# Altium schematic sheet Sheet1.SchDoc
size A2
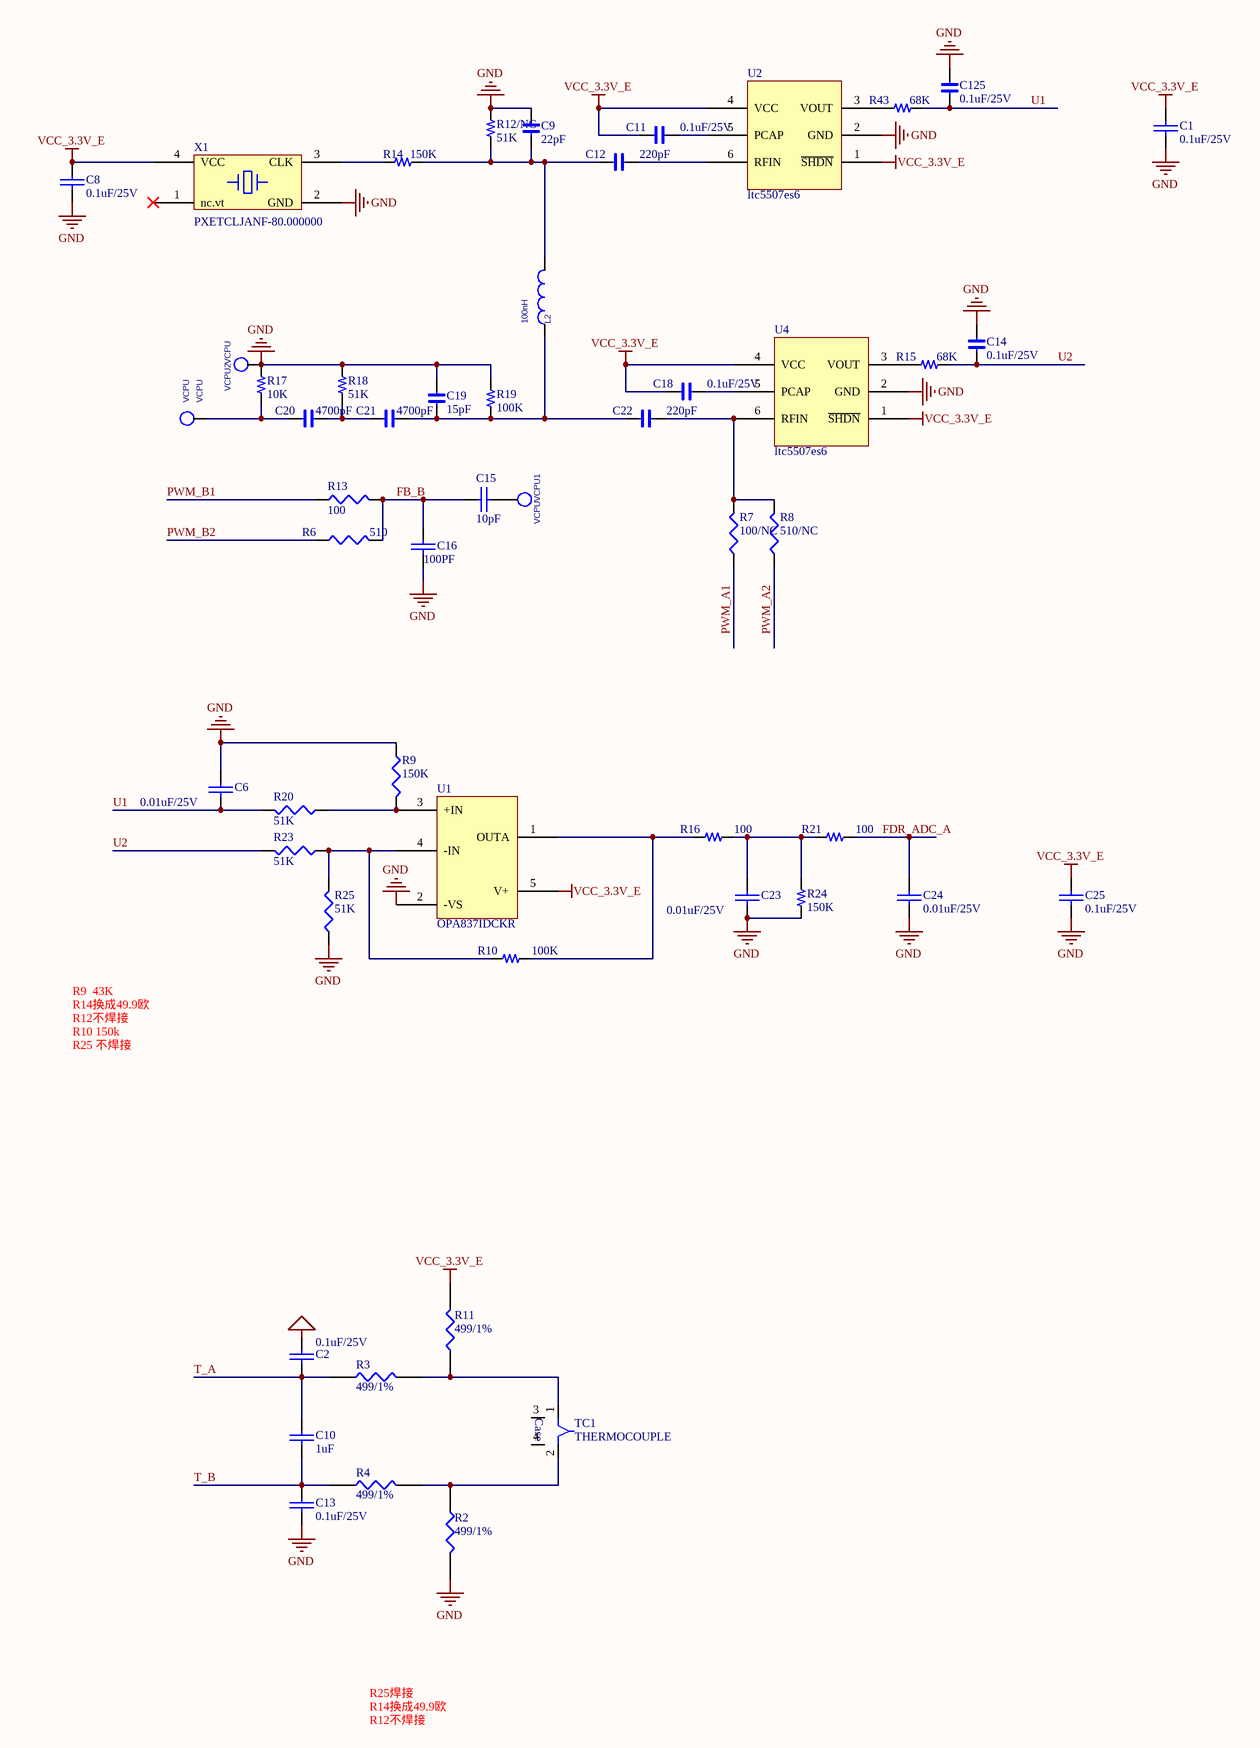
[diagram p0: Sheet1.SchDoc]

## Parts
C1  0.1uF/25V  [0603C]
C2  0.1uF/25V  [0603c]
C6  0.01uF/25V  [0603C]
C8  0.1uF/25V  [0603C]
C9  22pF  [0603C]
C10  1uF  [0603c]
C11  0.1uF/25V  [0603C]
C12  220pF  [0603C]
C13  0.1uF/25V  [0603c]
C14  0.1uF/25V  [0603C]
C15  10pF  [0603C]
C16  100PF  [0603C]
C18  0.1uF/25V  [0603C]
C19  15pF  [0603C]
C20  4700pF  [0603C]
C21  4700pF  [0603C]
C22  220pF  [0603C]
C23  0.01uF/25V  [0603C]
C24  0.01uF/25V  [0603C]
C25  0.1uF/25V  [0603C]
C125  0.1uF/25V  [0603C]
L2  100nH  [0603R]
R2  499/1%  [0603r]
R3  499/1%  [0603r]
R4  499/1%  [0603r]
R6  510  [0603R]
R7  100/NC  [0603R]
R8  510/NC  [0603R]
R9  150K  [0603R]
R10  100K  [0603R]
R11  499/1%  [0603r]
R12/NC  51K  [0603r]
R13  100  [0603R]
R14  150K  [0603r]
R15  68K  [0603r]
R16  100  [0603R]
R17  10K  [0603r]
R18  51K  [0603r]
R19  100K  [0603r]
R20  51K  [0603R]
R21  100  [0603R]
R23  51K  [0603R]
R24  150K  [0603R]
R25  51K  [0603R]
R43  68K  [0603r]
TC1  THERMOCOUPLE  [0603R]
U1  OPA837IDCKR  [SC70-5]
U2  ltc5507es6  [SOT23-6]
U4  ltc5507es6  [SOT23-6]
VCPU  VCPU  [probe]
VCPU1  VCPU  [probe]
VCPU2  VCPU  [probe]
X1  PXETCLJANF-80.000000  [XTAL4TN_7050]

## Nets
GND: C1.1 C2.2 C6.2 C8.2 C9.1 C13.2 C14.2 C16.2 C19.2 C23.1 C24.1 C25.1 C125.2 R2.2 R9.1 R12/NC.2 R17.2 R18.2 R19.2 R24.1 R25.1 U1.2(-VS) U2.2(GND) U4.2(GND) VCPU2.1(TP) X1.2(GND)
VCC_3.3V_E: C1.2 C8.1 C11.1 C18.1 C25.2 R11.2 U1.5(V+) U2.1(~{SHDN}) U2.4(VCC) U4.1(~{SHDN}) U4.4(VCC) X1.4(VCC)
FB_B: C15.1 C16.1 R6.2 R13.2
FDR_ADC_A: C24.2 R21.2
PWM_A1: R7.1
PWM_A2: R8.1
PWM_B1: R13.1
PWM_B2: R6.1
T_A: C2.1 C10.1 R3.1
T_B: C10.2 C13.1 R4.1
U1: C6.1 C125.1 R20.2 R43.1
U2: C14.1 R15.1 R23.2
NetC9_2: C9.2 C12.1 L2.2 R12/NC.1 R14.2
NetC11_2: C11.2 U2.5(PCAP)
NetC12_2: C12.2 U2.6(RFIN)
NetC15_2: C15.2 VCPU1.1(TP)
NetC18_2: C18.2 U4.5(PCAP)
NetC19_1: C19.1 C21.2 C22.1 L2.1 R19.1
NetC20_1: C20.1 R17.1 VCPU.1(TP)
NetC20_2: C20.2 C21.1 R18.1
NetC22_2: C22.2 R7.2 R8.2 U4.6(RFIN)
NetC23_2: C23.2 R16.2 R21.1 R24.2
NetR2_1: R2.1 R4.2 TC1.2
NetR3_2: R3.2 R11.1 TC1.1
NetR9_2: R9.2 R20.1 U1.3(+IN)
NetR10_1: R10.1 R23.1 R25.2 U1.4(-IN)
NetR10_2: R10.2 R16.1 U1.1(OUTA)
NetR14_1: R14.1 X1.3(CLK)
NetR15_2: R15.2 U4.3(VOUT)
NetR43_2: R43.2 U2.3(VOUT)

Not connected (* = marked no-connect by the designer): TC1 3 4; X1 1(nc.vt)*

## Notes on the sheet
- R9  43K
- R14뻣냥49.9킹
- R12꼇보쌈
- R10 150k
- R25 꼇보쌈
- R25보쌈
- (in symbol THERMOCOUPLE) Case

## Library data of the parts
C1 C2 C6 C8 C10 C13 C15 C16 C23-C25 = CAP: Capacitor
C9 C11 C12 C14 C18-C22 C125 = C
L2 = INDUCTOR_1
R2-R4 R11 = RES1
R6-R9 R13 R20 R23 R25 = Res3: Resistor; Published: 8-Jun-2000; LatestRevisionDate: 29-May-2009; LatestRevisionNote: IPC-7351 Footprint Added.; PackageReference: J1-0603; Publisher: Altium Limited; PackageDescription: Chip Resistor
R10 R12/NC R14-R19 R21 R24 R43 = R
U1 = OPA837 DCK
VCPU VCPU1 VCPU2 = T_POINT_R
X1 = XTAL4S